# Altium schematic sheet GNSS_OCXO.SchDoc
size A3; DocumentNumber: 4; SheetNumber: 4; SheetTotal: 4
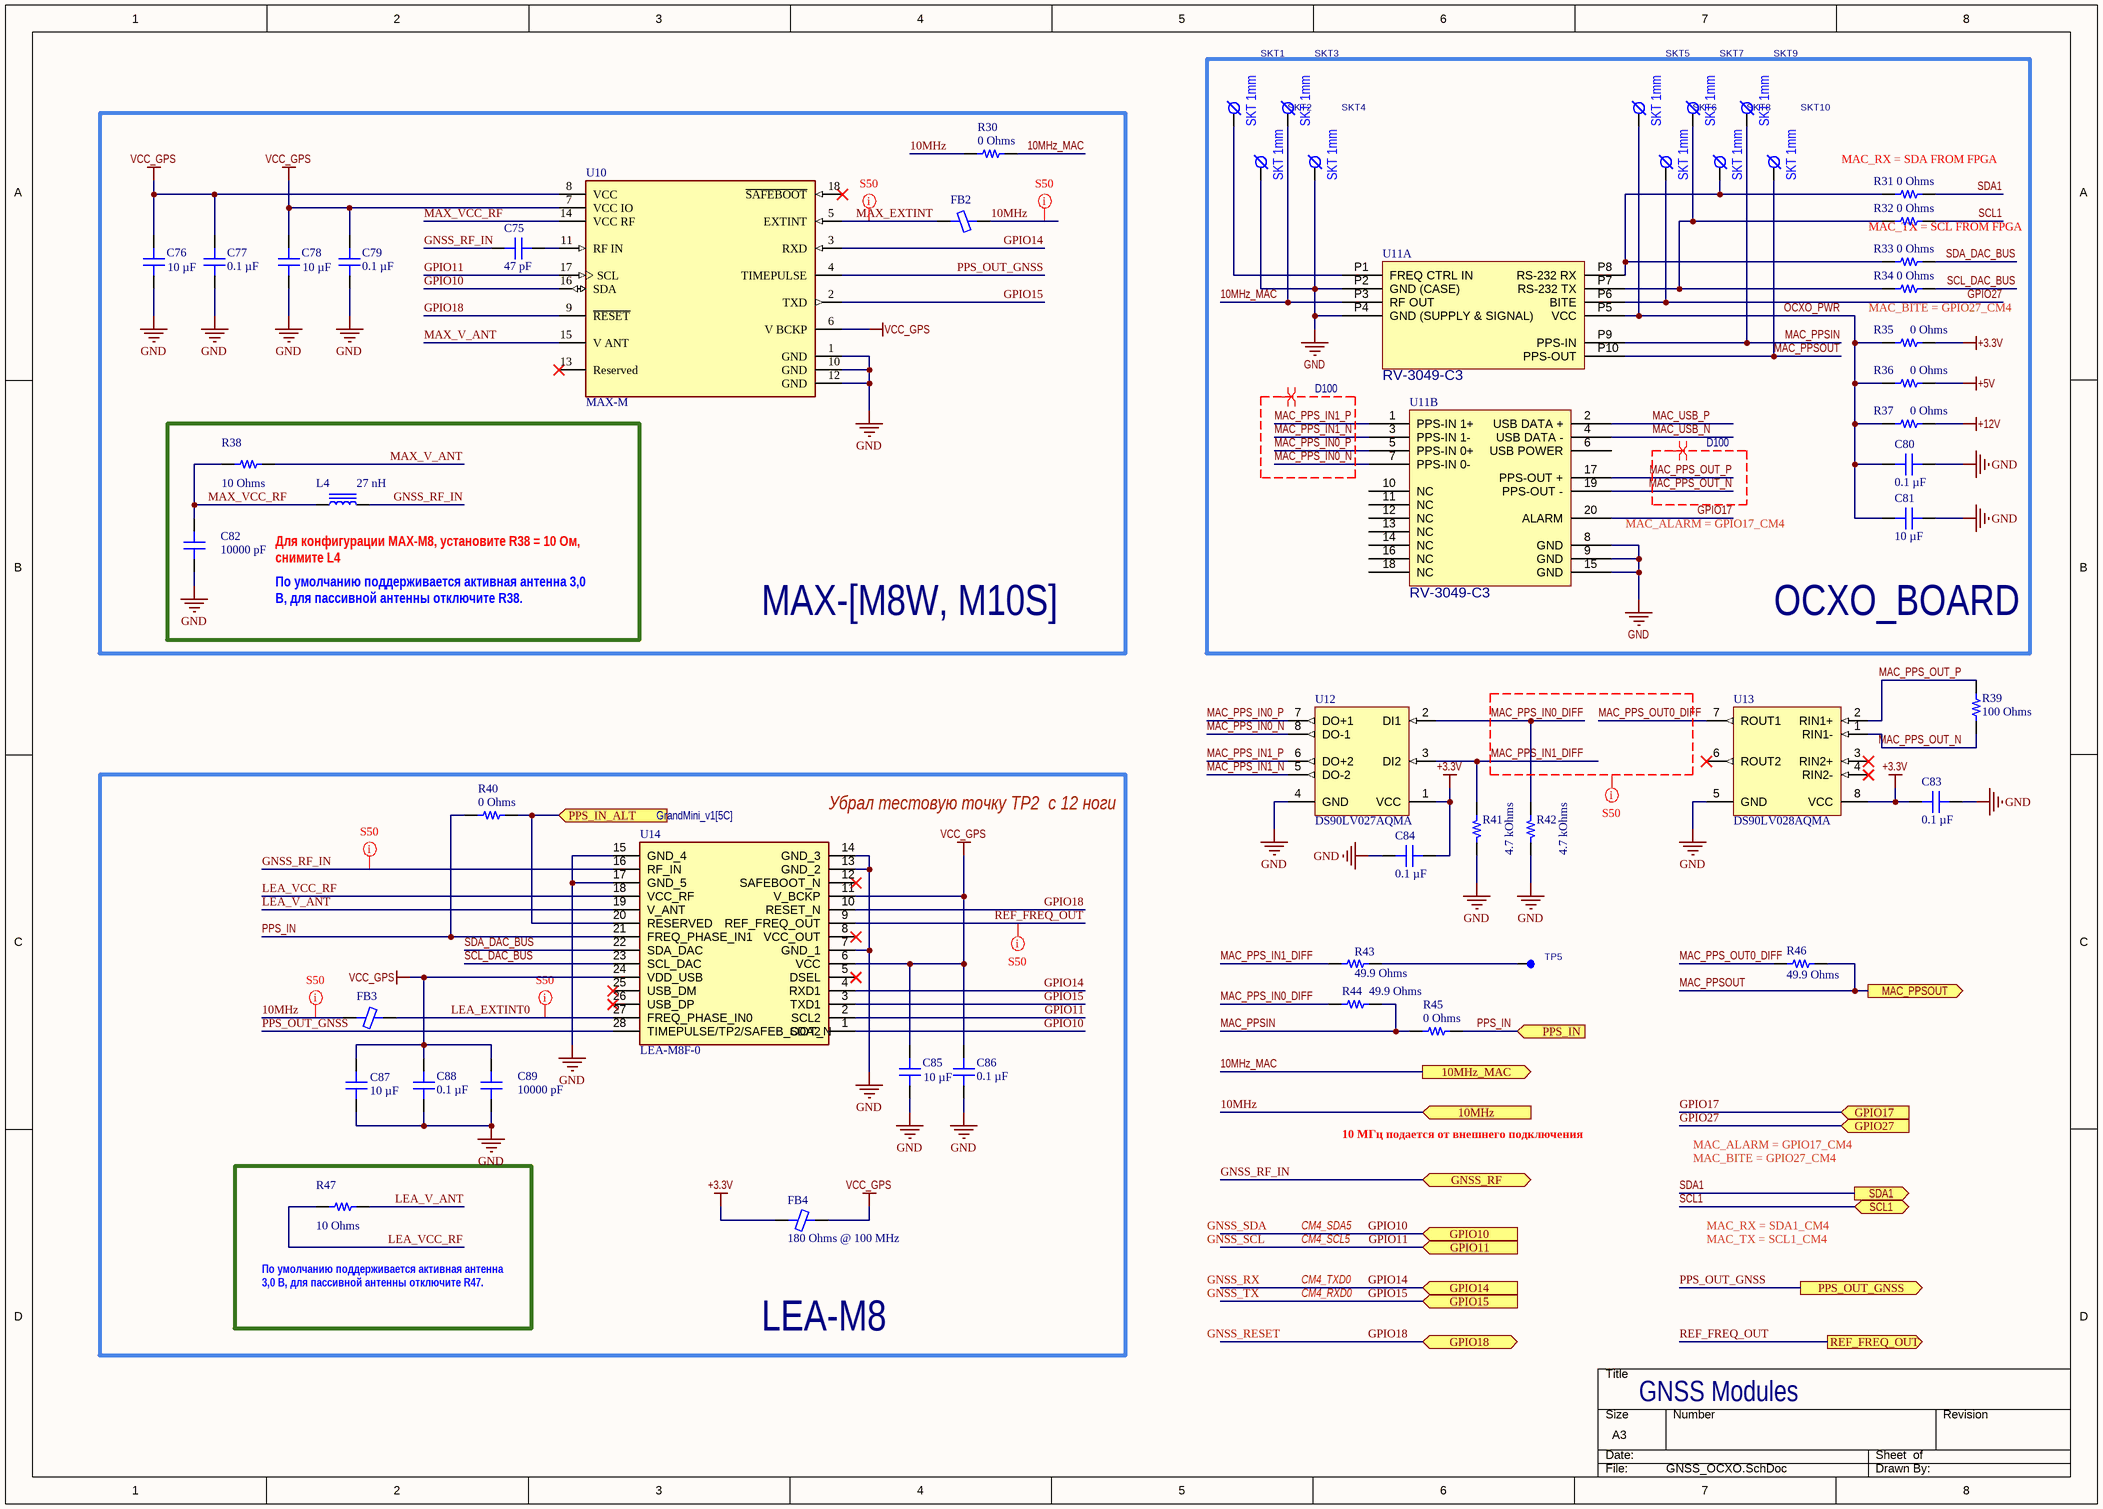
[diagram p0: GNSS_OCXO.SchDoc]

## Parts
C75  47 pF  [CAP 0603_1608]
C76  10 µF  [CAP 0805_2012]
C77  0.1 µF  [CAP 0603_1608]
C78  10 µF  [CAP 0805_2012]
C79  0.1 µF  [CAP 0603_1608]
C80  0.1 µF  [CAP 0603_1608]
C81  10 µF  [CAP 0805_2012]
C82  10000 pF  [CAP 0603_1608]
C83  0.1 µF  [CAP 0603_1608]
C84  0.1 µF  [CAP 0603_1608]
C85  10 µF  [CAP 0805_2012]
C86  0.1 µF  [CAP 0603_1608]
C87  10 µF  [CAP 0805_2012]
C88  0.1 µF  [CAP 0603_1608]
C89  10000 pF  [CAP 0603_1608]
FB2  1 kOhms @ 100 MHz  [FER 0603_1608]  (value not drawn)
FB3  1 kOhms @ 100 MHz  [FER 0603_1608]  (value not drawn)
FB4  180 Ohms @ 100 MHz  [FER 0603_1608]
L4  27 nH  [Murata LQW18 0603]
R30  0 Ohms  [YAGEO RES 0603_1608]
R31  0 Ohms  [YAGEO RES 0603_1608]
R32  0 Ohms  [YAGEO RES 0603_1608]
R33  0 Ohms  [YAGEO RES 0603_1608]
R34  0 Ohms  [YAGEO RES 0603_1608]
R35  0 Ohms  [YAGEO RES 0603_1608]
R36  0 Ohms  [YAGEO RES 0603_1608]
R37  0 Ohms  [YAGEO RES 0603_1608]
R38  10 Ohms  [YAGEO RES 0603_1608]
R39  100 Ohms  [YAGEO RES 0603_1608]
R40  0 Ohms  [YAGEO RES 0603_1608]
R41  4.7 kOhms  [YAGEO RES 0402_1005]
R42  4.7 kOhms  [YAGEO RES 0402_1005]
R43  49.9 Ohms  [YAGEO RES 0603_1608]
R44  49.9 Ohms  [YAGEO RES 0603_1608]
R45  0 Ohms  [YAGEO RES 0603_1608]
R46  49.9 Ohms  [YAGEO RES 0603_1608]
R47  10 Ohms  [YAGEO RES 0603_1608]
SKT1  SKT plug  [0332-0-43-80-18-27-10-0]  (value not drawn)
SKT2  SKT plug  [0332-0-43-80-18-27-10-0]  (value not drawn)
SKT3  SKT plug  [0332-0-43-80-18-27-10-0]  (value not drawn)
SKT4  SKT plug  [0332-0-43-80-18-27-10-0]  (value not drawn)
SKT5  SKT plug  [0332-0-43-80-18-27-10-0]  (value not drawn)
SKT6  SKT plug  [0332-0-43-80-18-27-10-0]  (value not drawn)
SKT7  SKT plug  [0332-0-43-80-18-27-10-0]  (value not drawn)
SKT8  SKT plug  [0332-0-43-80-18-27-10-0]  (value not drawn)
SKT9  SKT plug  [0332-0-43-80-18-27-10-0]  (value not drawn)
SKT10  SKT plug  [0332-0-43-80-18-27-10-0]  (value not drawn)
TP5  PAD_TEST  [PAD_TEST]  (value not drawn)  (no BOM)
U10  MAX-M  [FP-MAX-M8W-0-MFG]
U11  value RV-3049-C3  [OCXO_CARD]  (hidden comment: MAC-SA5X)  (parts A,B of 2)
U12  DS90LV027AQMA  [M08A_N]
U13  DS90LV028AQMA  [M08A_L]
U14  LEA-M8F-0  [LEAM8F0]

## Blocks framed on the sheet
OCXO_BOARD: C80 C81 R31-R37 SKT1-SKT10 U11
MAX-[M8W, M10S]: C75-C79 C82 FB2 L4 R30 R38 U10
LEA-M8: C85-C89 FB3 FB4 R40 R47 U14

## Ports
10MHz (in, see GrandMini_v1[5B]), 10MHz_MAC (out, see GrandMini_v1[5B]), GNSS_RF (bidir, see GrandMini_v1[5B]), GPIO10 (in, see GrandMini_v1[5B], CM4_GPIO[6A]), GPIO11 (in, see GrandMini_v1[5B], CM4_GPIO[6A]), GPIO14 (in, see GrandMini_v1[5B], CM4_GPIO[8A]), GPIO15 (in, see GrandMini_v1[5B], CM4_GPIO[8A]), GPIO17 (in, see GrandMini_v1[5B], CM4_GPIO[6A]), GPIO18 (bidir, see GrandMini_v1[5B], CM4_GPIO[8A]), GPIO27 (in, see GrandMini_v1[5B], CM4_GPIO[6A]), MAC_PPSOUT (out, see GrandMini_v1[5C]), PPS_IN (in, see GrandMini_v1[5B]), PPS_IN_ALT (in, see GrandMini_v1[5C]), PPS_OUT_GNSS (out, see GrandMini_v1[5C]), REF_FREQ_OUT (out, see GrandMini_v1[5C]), SCL1 (bidir, see GrandMini_v1[5C], CM4_GPIO[5B]), SDA1 (out, see GrandMini_v1[5C], CM4_GPIO[2B])

## Nets
+3.3V: C83.1 C84.2 FB4.1 R35.1 U12.1(VCC) U13.8(VCC)
+5V: R36.1
+12V: R37.1
GND: C76.1 C77.1 C78.1 C79.1 C80.2 C81.1 C82.1 C83.2 C84.1 C85.1 C86.1 C87.1 C88.1 C89.1 R41.1 R42.1 SKT2.1 SKT4.1 U10.1(GND) U10.10(GND) U10.12(GND) U11.8(GND) U11.9(GND) U11.15(GND) U11.P2(GND_(CASE)) U11.P4(GND_(SUPPLY_&_SIGNAL)) U12.4(GND) U13.5(GND) U14.7(GND_1) U14.13(GND_2) U14.14(GND_3) U14.15(GND_4) U14.17(GND_5)
VCC_GPS: C76.2 C77.2 C78.2 C79.2 C85.2 C86.2 C87.2 C88.2 C89.2 FB4.2 U10.6(V_BCKP) U10.7(VCC_IO) U10.8(VCC) U14.6(VCC) U14.11(V_BCKP) U14.24(VDD_USB)
10MHz: FB2.1 FB3.1 R30.1 ; port 10MHz
10MHz_MAC: R30.2 SKT3.1 U11.P3(RF_OUT) ; port 10MHz_MAC
GNSS_RF_IN: C75.1 L4.2 U14.16(RF_IN) ; port GNSS_RF
GPIO10: U10.16(SDA) U14.1(SDA2) ; port GPIO10
GPIO11: U10.17(SCL) U14.2(SCL2) ; port GPIO11
GPIO14: U10.3(RXD) U14.4(RXD1) ; port GPIO14
GPIO15: U10.2(TXD) U14.3(TXD1) ; port GPIO15
GPIO17: U11.20(ALARM) ; port GPIO17
GPIO18: U10.9(~{RESET}) U14.10(RESET_N) ; port GPIO18
GPIO27: SKT6.1 U11.P6(BITE) ; port GPIO27
LEA_EXTINT0: FB3.2 U14.27(FREQ_PHASE_IN0)
LEA_V_ANT: R47.2 U14.19(V_ANT)
LEA_VCC_RF: R47.1 U14.18(VCC_RF)
MAC_PPS_IN0_DIFF: R42.2 R44.1 U12.2(DI1)
MAC_PPS_IN0_N: U11.7(PPS-IN_0-) U12.8(DO-1)
MAC_PPS_IN0_P: U11.5(PPS-IN_0+) U12.7(DO+1)
MAC_PPS_IN1_DIFF: R41.2 R43.1 U12.3(DI2)
MAC_PPS_IN1_N: U11.3(PPS-IN_1-) U12.5(DO-2)
MAC_PPS_IN1_P: U11.1(PPS-IN_1+) U12.6(DO+2)
MAC_PPS_OUT0_DIFF: R46.1 U13.7(ROUT1)
MAC_PPS_OUT_N: R39.1 U11.19(PPS-OUT_-) U13.1(RIN1-)
MAC_PPS_OUT_P: R39.2 U11.17(PPS-OUT_+) U13.2(RIN1+)
MAC_PPSIN: R44.2 R45.1 SKT9.1 U11.P9(PPS-IN)
MAC_PPSOUT: R46.2 SKT10.1 U11.P10(PPS-OUT) ; port MAC_PPSOUT
MAC_USB_N: U11.4(USB_DATA_-)
MAC_USB_P: U11.2(USB_DATA_+)
MAX_EXTINT: FB2.2 U10.5(EXTINT)
MAX_V_ANT: R38.2 U10.15(V_ANT)
MAX_VCC_RF: C82.2 L4.1 R38.1 U10.14(VCC_RF)
OCXO_PWR: C80.1 C81.2 R35.2 R36.2 R37.2 SKT5.1 U11.P5(VCC)
PPS_IN: R40.1 R45.2 U14.21(FREQ_PHASE_IN1) ; port PPS_IN
PPS_IN_ALT: R40.2 U14.20(RESERVED) ; port PPS_IN_ALT
PPS_OUT_GNSS: U10.4(TIMEPULSE) U14.28(TIMEPULSE/TP2/SAFEB_OOT_N) ; port PPS_OUT_GNSS
REF_FREQ_OUT: U14.9(REF_FREQ_OUT) ; port REF_FREQ_OUT
SCL1: R32.1 ; port SCL1
SCL_DAC_BUS: R34.1 U14.23(SCL_DAC)
SDA1: R31.1 ; port SDA1
SDA_DAC_BUS: R33.1 U14.22(SDA_DAC)
NetC75_2: C75.2 U10.11(RF_IN)
NetR31_2: R31.2 R33.2 SKT8.1 U11.P8(RS-232_RX)
NetR32_2: R32.2 R34.2 SKT7.1 U11.P7(RS-232_TX)
NetR43_2: R43.2 TP5.1
NetSKT1_1: SKT1.1 U11.P1(FREQ_CTRL_IN)

Not connected (* = marked no-connect by the designer): U10 13(Reserved)* 18(~{SAFEBOOT})*; U11 6(USB_POWER) 10(NC) 11(NC) 12(NC) 13(NC) 14(NC) 16(NC) 18(NC); U13 3(RIN2+)* 4(RIN2-)* 6(ROUT2)*; U14 5(DSEL)* 8(VCC_OUT)* 12(SAFEBOOT_N)* 25(USB_DM)* 26(USB_DP)*

## Layout directives
net class S50: 10MHz, GNSS_RF_IN, LEA_EXTINT0, MAC_PPS_IN0_DIFF, MAC_PPS_IN1_DIFF, MAC_PPS_OUT0_DIFF, MAX_EXTINT, REF_FREQ_OUT
differential pair; differential pair class D100: MAC_PPS_IN0_N, MAC_PPS_IN0_P, MAC_PPS_IN1_N, MAC_PPS_IN1_P, MAC_PPS_OUT_N, MAC_PPS_OUT_P

## Notes on the sheet
- (near R31) MAC_RX = SDA FROM FPGA
- (near R32) MAC_TX = SCL FROM FPGA
- (near R34) MAC_BITE = GPIO27_CM4
- (near L4) Для конфигурации MAX-M8, установите R38 = 10 Ом, снимите L4
- MAC_ALARM = GPIO17_CM4
- По умолчанию поддерживается активная антенна 3,0 В, для пассивной антенны отключите R38.
- (near U14) Убрал тестовую точку TP2  c 12 ноги
- 10 МГц подается от внешнего подключения
- MAC_BITE = GPIO27_CM4
- GNSS_SDA
- GNSS_SCL
- CM4_SDA5
- CM4_SCL5
- MAC_TX = SCL1_CM4
- MAC_RX = SDA1_CM4
- По умолчанию поддерживается активная антенна 3,0 В, для пассивной антенны отключите R47.
- GNSS_RX
- GNSS_TX
- CM4_TXD0
- CM4_RXD0
- GNSS_RESET
- GNSS Modules
- DWG. NO.
- REV.
- SHT.
- REVISION
- DESCRIPTION
- DATE
- APPROVED
- THIS DOCUMENT AND THE DATA DISCLOSED HEREIN OR HEREWITH IS THE PROPERTY OF ALTIUM LIMITED AND MAY BE FREELY DISTRIBUTED IN WHOLE. NO RIGHTS ARE RESERVED OR EXPRESS OR IMPLIED WARANTEE GIVEN.
- ENG:
- DSN:
- APPROVALS
- PROJECT
- DOCUMENT REVISION:
- DESIGN ITEM:
- CHK:
- BOM:
- REFERENCE DOCUMENTS
- PROJECT REVISION:
- TITLE
- FAB DWG:
- PCB DWG:
- ASSY DWG:
- SCALE:
- SIZE
- C
- CAGE CODE
- FILE NAME
- DWG NO.
- SHEET
- OF
- REV
- (in symbol 0332-0-43-80-18-27-10-0) SKT 1mm

## Library data of the parts
C75 = CC0603JRNPO8BN470: CAP CER 47PF 25V C0G/NPO 0603; manufacturer: Yageo; Temperature Coefficient: C0G, NP0; Tolerance: ±5%; Value: 47 pF; Capacitance: 47 pF; componentlink2url: https://www.digikey.com/en/products/detail/yageo/CC0603JRNPO8BN470/5883596; componentlink2description: DigiKey Link; Part Number: CC0603JRNPO8BN470; Applications: General Purpose; componentlink1description: Datasheet; componentlink1url: https://www.yageo.com/upload/media/product/productsearch/datasheet/mlcc/UPY-GP_NP0_16V-to-50V_17.pdf; Device Package: 0603 (1608 Metric); lastupdated: 09.02.2024 20:10:21; Lifecycle Status: Active; Minimum Order: 1; Mounting Type: Surface Mount, MLCC; Operating Temperature: -55°C ~ 125°C; Package / Case: 0603 (1608 Metric); packaging: TapeAndReel; partid: 9428; Part Status: Active; price: 0.01; series: CC; Size / Dimension: 0.063" L x 0.031" W (1.60mm x 0.80mm); Supplier 1: DigiKey; Supplier Part Number 1: 311-3955-1-ND; Thickness (Max): 0.035" (0.90mm); Voltage - Rated: 25V
C76 C78 C81 C85 C87 = CC0805KKX5R8BB106: CAP CER 10UF 25V X5R 0805; manufacturer: Yageo; Tolerance: ±10%; series: CC; packaging: TapeAndReel; Capacitance: 10 µF; Part Number: CC0805KKX5R8BB106; Applications: General Purpose; componentlink1description: Datasheet; componentlink1url: https://www.yageo.com/upload/media/product/productsearch/datasheet/mlcc/UPY-GPHC_X5R_4V-to-50V_25.pdf; componentlink2description: DigiKey Link; componentlink2url: https://www.digikey.com/en/products/detail/yageo/CC0805KKX5R8BB106/5195275; Device Package: 0805 (2012 Metric); lastupdated: 09.02.2024 20:15:28; Lifecycle Status: Active; Minimum Order: 1; Mounting Type: Surface Mount, MLCC; Operating Temperature: -55°C ~ 85°C; Package / Case: 0805 (2012 Metric); partid: 16151; Part Status: Active; price: 0.06; Size / Dimension: 0.079" L x 0.049" W (2.00mm x 1.25mm); Supplier 1: DigiKey; Supplier Part Number 1: 311-1869-1-ND; Temperature Coefficient: X5R; Thickness (Max): 0.057" (1.45mm); Voltage - Rated: 25V; Value: 10 µF
C77 C79 C80 C83 C84 C86 C88 = CC0603KRX7R9BB104: CAP CER 0.1UF 50V X7R 0603; manufacturer: Yageo; Tolerance: ±10%; componentlink2url: https://www.digikey.com/en/products/detail/yageo/CC0603KRX7R9BB104/2103082; Value: 0.1 µF; componentlink2description: DigiKey Link; Temperature Coefficient: X7R; Capacitance: 0.1 µF; Part Number: CC0603KRX7R9BB104; Applications: General Purpose; componentlink1description: Datasheet; componentlink1url: https://www.yageo.com/upload/media/product/productsearch/datasheet/mlcc/UPY-GPHC_X7R_6.3V-to-50V_18.pdf; Device Package: 0603 (1608 Metric); lastupdated: 09.02.2024 20:10:21; Lifecycle Status: Active; Minimum Order: 1; Mounting Type: Surface Mount, MLCC; Operating Temperature: -55°C ~ 125°C; Package / Case: 0603 (1608 Metric); packaging: TapeAndReel; partid: 9506; Part Status: Active; price: 0.01; series: CC; Size / Dimension: 0.063" L x 0.031" W (1.60mm x 0.80mm); Supplier 1: DigiKey; Supplier Part Number 1: 311-1344-1-ND; Thickness (Max): 0.035" (0.90mm); Voltage - Rated: 50V
C82 C89 = CC0603KRX7R9BB103: CAP CER 10000PF 50V X7R 0603; manufacturer: Yageo; Tolerance: ±10%; Part Number: CC0603KRX7R9BB103; Supplier 1: DigiKey; Supplier Part Number 1: 311-1085-1-ND; Capacitance: 10000 pF; packaging: TapeAndReel; series: CC; componentlink1url: https://www.yageo.com/upload/media/product/productsearch/datasheet/mlcc/UPY-GPHC_X7R_6.3V-to-50V_18.pdf; componentlink1description: Datasheet; componentlink2url: https://www.digikey.com/en/products/detail/yageo/CC0603KRX7R9BB103/302819; componentlink2description: DigiKey Link; Value: 10000 pF; Applications: General Purpose; Device Package: 0603 (1608 Metric); lastupdated: 09.02.2024 20:10:06; Lifecycle Status: Active; Minimum Order: 1; Mounting Type: Surface Mount, MLCC; Operating Temperature: -55°C ~ 125°C; Package / Case: 0603 (1608 Metric); partid: 17848; Part Status: Active; price: 0.01; Size / Dimension: 0.063" L x 0.031" W (1.60mm x 0.80mm); Temperature Coefficient: X7R; Thickness (Max): 0.035" (0.90mm); Voltage - Rated: 50V
FB2 FB3 = BLM18HG102SH1D: FERRITE BEAD 1K OHM 0603 1LN; Manufacturer: Murata Electronics; Number of Lines: 1; Current Rating (Max): 100mA; DC Resistance (DCR) (Max): 1.6Ohm; Ratings: AEC-Q200; Packaging: TapeAndReel; Part Number: BLM18HG102SH1D; ComponentLink1Description: Datasheet; ComponentLink1URL: https://www.murata.com/en-us/products/productdata/8796750675998/QNFA9104.pdf; ComponentLink2Description: DigiKey Link; ComponentLink2URL: https://www.digikey.com/en/products/detail/murata-electronics/BLM18HG102SH1D/2588039; Device Package: 0603 (1608 Metric); Height (Max): 0.037" (0.95mm); Impedance @ Frequency: 1 kOhms @ 100 MHz; LastUpdated: 03.06.2024 19:51:54; Lifecycle Status: Active; Minimum Order: 1; Mounting Type: Surface Mount; Operating Temperature: -55°C ~ 125°C; Package / Case: 0603 (1608 Metric); PartId: 731; Part Status: Active; Price: 0.05; Series: EMIFIL®, BLM18; Size / Dimension: 0.063" L x 0.032" W (1.60mm x 0.80mm); Supplier 1: DigiKey; Supplier Part Number 1: 490-11033-1-ND; Value: 1 kOhms @ 100 MHz
FB4 = BLM18PG181SN1D: FERRITE BEAD 180 OHM 0603 1LN; Manufacturer: Murata Electronics; Current Rating (Max): 1.5A; DC Resistance (DCR) (Max): 90mOhm; Filter Type: Power Line; Number of Lines: 1; Part Number: BLM18PG181SN1D; ComponentLink1Description: Datasheet; ComponentLink1URL: https://www.murata.com/en-us/products/productdata/8796738650142/ENFA0003.pdf; ComponentLink2Description: DigiKey Link; ComponentLink2URL: https://www.digikey.com/en/products/detail/murata-electronics/BLM18PG181SN1D/1634634; Device Package: 0603 (1608 Metric); Height (Max): 0.037" (0.95mm); Impedance @ Frequency: 180 Ohms @ 100 MHz; LastUpdated: 03.06.2024 19:51:52; Lifecycle Status: Active; Minimum Order: 1; Mounting Type: Surface Mount; Operating Temperature: -55°C ~ 125°C; Package / Case: 0603 (1608 Metric); Packaging: TapeAndReel; PartId: 858; Part Status: Active; Price: 0.02; Series: EMIFIL®, BLM18; Size / Dimension: 0.063" L x 0.032" W (1.60mm x 0.80mm); Supplier 1: DigiKey; Supplier Part Number 1: 490-5263-1-ND; Value: 180 Ohms @ 100 MHz
L4 = LQW18AN27NG00D: FIXED IND 27NH 440MA 0.21OHM SMD; Manufacturer: Murata Electronics; Tolerance: ±2%; DC Resistance (DCR): 210mOhm Max; Shielding: Unshielded; Frequency - Self Resonant: 3.7GHz; Inductance Frequency - Test: 100 MHz; Material - Core: Non-Magnetic; Q @ Freq: 40 @ 250MHz; Type: Drum Core, Wirewound; Inductance: 27 nH; Height - Seated (Max): 0.039" (1.00mm); Packaging: TapeAndReel; Part Number: LQW18AN27NG00D; ComponentLink1Description: Datasheet; ComponentLink1URL: https://search.murata.co.jp/Ceramy/image/img/P02/JELF243A-0024.pdf; ComponentLink2Description: DigiKey Link; ComponentLink2URL: https://www.digikey.com/en/products/detail/murata-electronics/LQW18AN27NG00D/2594997; Current Rating (Amps): 440 mA; Device Package: 0603 (1608 Metric); LastUpdated: 20.07.2024 2:35:39; Lifecycle Status: Active; Minimum Order: 1; Mounting Type: Surface Mount; Operating Temperature: -55°C ~ 125°C; Package / Case: 0603 (1608 Metric); PartId: 1393; Part Status: Active; Price: 0.05; Series: LQW18; Size / Dimension: 0.063" L x 0.031" W (1.60mm x 0.80mm); Supplier 1: DigiKey; Supplier Part Number 1: 490-6879-1-ND; Supplier Device Package: 0603 (1608 Metric); Value: 27 nH
R30-R37 R40 R45 = RC0603FR-070RL: RES 0 OHM JUMPER 1/10W 0603; Manufacturer: Yageo; Power (Watts): 0.1W, 1/10W; Tolerance: Jumper; Resistance: 0 Ohms; Packaging: CutTape; Composition: Thick Film; Part Number: RC0603FR-070RL; Value: 0 Ohms; ComponentLink1Description: Datasheet; ComponentLink1URL: https://www.yageo.com/upload/media/product/productsearch/datasheet/rchip/PYu-RC_Group_51_RoHS_L_10.pdf; ComponentLink2Description: DigiKey Link; ComponentLink2URL: https://www.digikey.com/en/products/detail/yageo/RC0603FR-070RL/1304008; Device Package: 0603 (1608 Metric); Features: Moisture Resistant; Height - Seated (Max): 0.022" (0.55mm); LastUpdated: 25.07.2024 9:19:19; Lifecycle Status: Active; Minimum Order: 1; Number of Terminations: 2; Operating Temperature: -55°C ~ 155°C; Package / Case: 0603 (1608 Metric); PartId: 22614; Part Status: Active; Price: 0.01; Series: RC_L; Size / Dimension: 0.063" L x 0.031" W (1.60mm x 0.80mm); Supplier 1: DigiKey; Supplier Part Number 1: 311-0.0HRCT-ND; Supplier Device Package: 0603
R38 R47 = RC0603FR-0710RL: RES 10 OHM 1% 1/10W 0603; Manufacturer: Yageo; Temperature Coefficient: ±200ppm/°C; Power (Watts): 0.1W, 1/10W; Resistance: 10 Ohms; Value: 10 Ohms; ComponentLink2URL: https://www.digikey.com/en/products/detail/yageo/RC0603FR-0710RL/726879; Tolerance: ±1%; ComponentLink2Description: DigiKey Link; Composition: Thick Film; Series: RC_L; Part Number: RC0603FR-0710RL; ComponentLink1Description: Datasheet; ComponentLink1URL: https://www.yageo.com/upload/media/product/productsearch/datasheet/rchip/PYu-RC_Group_51_RoHS_L_10.pdf; Device Package: 0603 (1608 Metric); Features: Moisture Resistant; Height - Seated (Max): 0.022" (0.55mm); LastUpdated: 25.07.2024 9:19:19; Lifecycle Status: Active; Minimum Order: 1; Number of Terminations: 2; Operating Temperature: -55°C ~ 155°C; Package / Case: 0603 (1608 Metric); Packaging: TapeAndReel; PartId: 22607; Part Status: Active; Price: 0.01; Size / Dimension: 0.063" L x 0.031" W (1.60mm x 0.80mm); Supplier 1: DigiKey; Supplier Part Number 1: 311-10.0HRCT-ND; Supplier Device Package: 0603
R39 = RC0603FR-07100RL: RES 100 OHM 1% 1/10W 0603; Manufacturer: Yageo; Power (Watts): 0.1W, 1/10W; Temperature Coefficient: ±100ppm/°C; Packaging: CutTape; ComponentLink2Description: DigiKey Link; ComponentLink1Description: Datasheet; ComponentLink2URL: https://www.digikey.com/en/products/detail/yageo/RC0603FR-07100RL/726888; ComponentLink1URL: https://www.yageo.com/upload/media/product/productsearch/datasheet/rchip/PYu-RC_Group_51_RoHS_L_10.pdf; Part Number: RC0603FR-07100RL; Value: 100 Ohms; Composition: Thick Film; Device Package: 0603 (1608 Metric); Features: Moisture Resistant; Height - Seated (Max): 0.022" (0.55mm); LastUpdated: 25.07.2024 9:19:19; Lifecycle Status: Active; Minimum Order: 1; Number of Terminations: 2; Operating Temperature: -55°C ~ 155°C; Package / Case: 0603 (1608 Metric); PartId: 22598; Part Status: Active; Price: 0.01; Resistance: 100 Ohms; Series: RC_L; Size / Dimension: 0.063" L x 0.031" W (1.60mm x 0.80mm); Supplier 1: DigiKey; Supplier Part Number 1: 311-100HRCT-ND; Supplier Device Package: 0603; Tolerance: ±1%
R41 R42 = RC0402FR-074K7L: RES 4.7K OHM 1% 1/16W 0402; Manufacturer: Yageo; Temperature Coefficient: ±100ppm/°C; Power (Watts): 0.063W, 1/16W; Series: RC_L; Resistance: 4.7 kOhms; Packaging: CutTape; Tolerance: ±1%; Part Number: RC0402FR-074K7L; Value: 4.7 kOhms; ComponentLink1Description: Datasheet; ComponentLink1URL: https://www.yageo.com/upload/media/product/productsearch/datasheet/rchip/PYu-RC_Group_51_RoHS_L_10.pdf; ComponentLink2Description: DigiKey Link; ComponentLink2URL: https://www.digikey.com/en/products/detail/yageo/RC0402FR-074K7L/2827563; Composition: Thick Film; Device Package: 0402 (1005 Metric); Features: Moisture Resistant; Height - Seated (Max): 0.016" (0.40mm); LastUpdated: 25.07.2024 9:18:11; Lifecycle Status: Active; Minimum Order: 1; Number of Terminations: 2; Operating Temperature: -55°C ~ 155°C; Package / Case: 0402 (1005 Metric); PartId: 17603; Part Status: Active; Price: 0.01; Size / Dimension: 0.039" L x 0.020" W (1.00mm x 0.50mm); Supplier 1: DigiKey; Supplier Part Number 1: 311-4.7KLRCT-ND; Supplier Device Package: 0402
R43 R44 R46 = RC0603FR-0749R9L: RES 49.9 OHM 1% 1/10W 0603; Manufacturer: Yageo; Power (Watts): 0.1W, 1/10W; Temperature Coefficient: ±100ppm/°C; Packaging: CutTape; ComponentLink2Description: DigiKey Link; ComponentLink1Description: Datasheet; ComponentLink2URL: https://www.digikey.com/en/products/detail/yageo/RC0603FR-0749R9L/727264; ComponentLink1URL: https://www.yageo.com/upload/media/product/productsearch/datasheet/rchip/PYu-RC_Group_51_RoHS_L_10.pdf; Part Number: RC0603FR-0749R9L; Value: 49.9 Ohms; Composition: Thick Film; Device Package: 0603 (1608 Metric); Features: Moisture Resistant; Height - Seated (Max): 0.022" (0.55mm); LastUpdated: 25.07.2024 9:19:17; Lifecycle Status: Active; Minimum Order: 1; Number of Terminations: 2; Operating Temperature: -55°C ~ 155°C; Package / Case: 0603 (1608 Metric); PartId: 23951; Part Status: Active; Price: 0.01; Resistance: 49.9 Ohms; Series: RC_L; Size / Dimension: 0.063" L x 0.031" W (1.60mm x 0.80mm); Supplier 1: DigiKey; Supplier Part Number 1: 311-49.9HRCT-ND; Supplier Device Package: 0603; Tolerance: ±1%
SKT1-SKT10 = 0332-0-43-80-18-27-10-0: PCB OFP SLDR MT RECPT #18 CNTCT .037-.043; Manufacturer: Mill-Max; Current: 8A; Value: 0332-0-43-80-18-27-10-0; Pin: 0.94-1.09mm
TP5 = PAD_TEST: Test Point; Manufacturer: {Manufacturer}; Reseller3: {Reseller3}; Reseller1: {Reseller1}; Tempcoeff: {Tempcoeff}; Reseller2: {Reseller2}; Tolerance: {Tolerance}; Value: .NetName; PowerVoltage: {PowerVoltage}; CatalogueCode: {CatalogueCode}; Case: {Case}
U10 = CMP-207130-000023-1: RF RCVR GNSS/GPS 1.575GHZ 18LCC; Current - Receiving: 23mA; Interface: I2C; Sensitivity: -167dBm; Frequency: 1.575GHz; Min Operating Temperature: -40°C; Packaging: Tape and Reel; RoHS Compliant: Yes; Max Operating Temperature: 85°C; Case/Package: SMD/SMT
U11 = MAC-SA5X: MOD, MAC, MAC-SA5X, ATOMIC CLOCK; VELENTIUM PART NUM: <V PART NUM>; MFG NAME: MICROCHIP; MAXTEMP: 85C; MINTEMP: -40C; OTHER: AEC-Q200; MODIFY DATE: 3/22/2006 1:36:44 PM; MFG PART NUM: MAC-SA5X; CATEGORY: MOD; P1: ATOMIC CLOCK; SHEETPART: *; DESC: MOD, MAC, MAC-SA5X, ATOMIC CLOCK
U12 = CMP-0058-01000-2: Automotive LVDS Dual Differential Driver, 8-pin Narrow SOIC; Manufacturer: National Semiconductor; PackageTopMarking: NSZXTT*90LV0*27AQM; CompType: Interface IC; PowerWise: N; DatasheetVersion: Oct-2008; PinCount: 8; RevisionNote: Component URLs added; Code_IPC: SOIC127P600-8; ComponentLink1URL: http://www.national.com/ds/DS/DS90LV027AQ.pdf; ComponentLink3Description: M08A Package Page; PackageDescription: SOIC Narrow, 4.9 x 3.9 x 1.45mm, 8 Lead, 1.27mm Pitch; ComponentLink2Description: DS90LV027AQ Web Page; ComponentLink2URL: http://www.national.com/pf/DS/DS90LV027AQ.html; RoHS: Y; Code_JEDEC: MS-012-AA; PackageReference: M08A; PackageVersion: revM, May-2009; ComponentLink1Description: DS90LV027AQ Datasheet; ComponentLink3URL: http://www.national.com/packaging/folders/m08a.html
U13 = CMP-0058-01010-2: Automotive LVDS Dual Differential Line Receiver, 8-pin Narrow SOIC; Manufacturer: National Semiconductor; PowerWise: N; PackageTopMarking: NSZXTT*90LV0*28AQM; CompType: Interface IC; DatasheetVersion: Oct-2008; PackageReference: M08A; RevisionNote: Component URLs added; Code_JEDEC: MS-012-AA; PackageVersion: revM, May-2009; ComponentLink1URL: http://www.national.com/ds/DS/DS90LV028AQ.pdf; PinCount: 8; ComponentLink3Description: M08A Package Page; ComponentLink1Description: DS90LV028AQ Datasheet; Code_IPC: SOIC127P600-8; RoHS: Y; ComponentLink2URL: http://www.national.com/pf/DS/DS90LV028AQ.html; PackageDescription: SOIC Narrow, 4.9 x 3.9 x 1.45mm, 8 Lead, 1.27mm Pitch; ComponentLink2Description: DS90LV028AQ Web Page; ComponentLink3URL: http://www.national.com/packaging/folders/m08a.html
U14 = LEA-M8F-0: Integrated Circuit; Manufacturer_Name: u-blox; Datasheet Link: https://content.u-blox.com/sites/default/files/documents/LEA-M8F_DataSheet_UBX-14001772.pdf; Height: 3.9mm; Manufacturer_Part_Number: LEA-M8F-0; Mouser Part Number: 377-LEA-M8F-0; Mouser Price/Stock: https://www.mouser.co.uk/ProductDetail/u-blox/LEA-M8F-0?qs=KUoIvG%2F9IlbqimLgpKzp4A%3D%3D